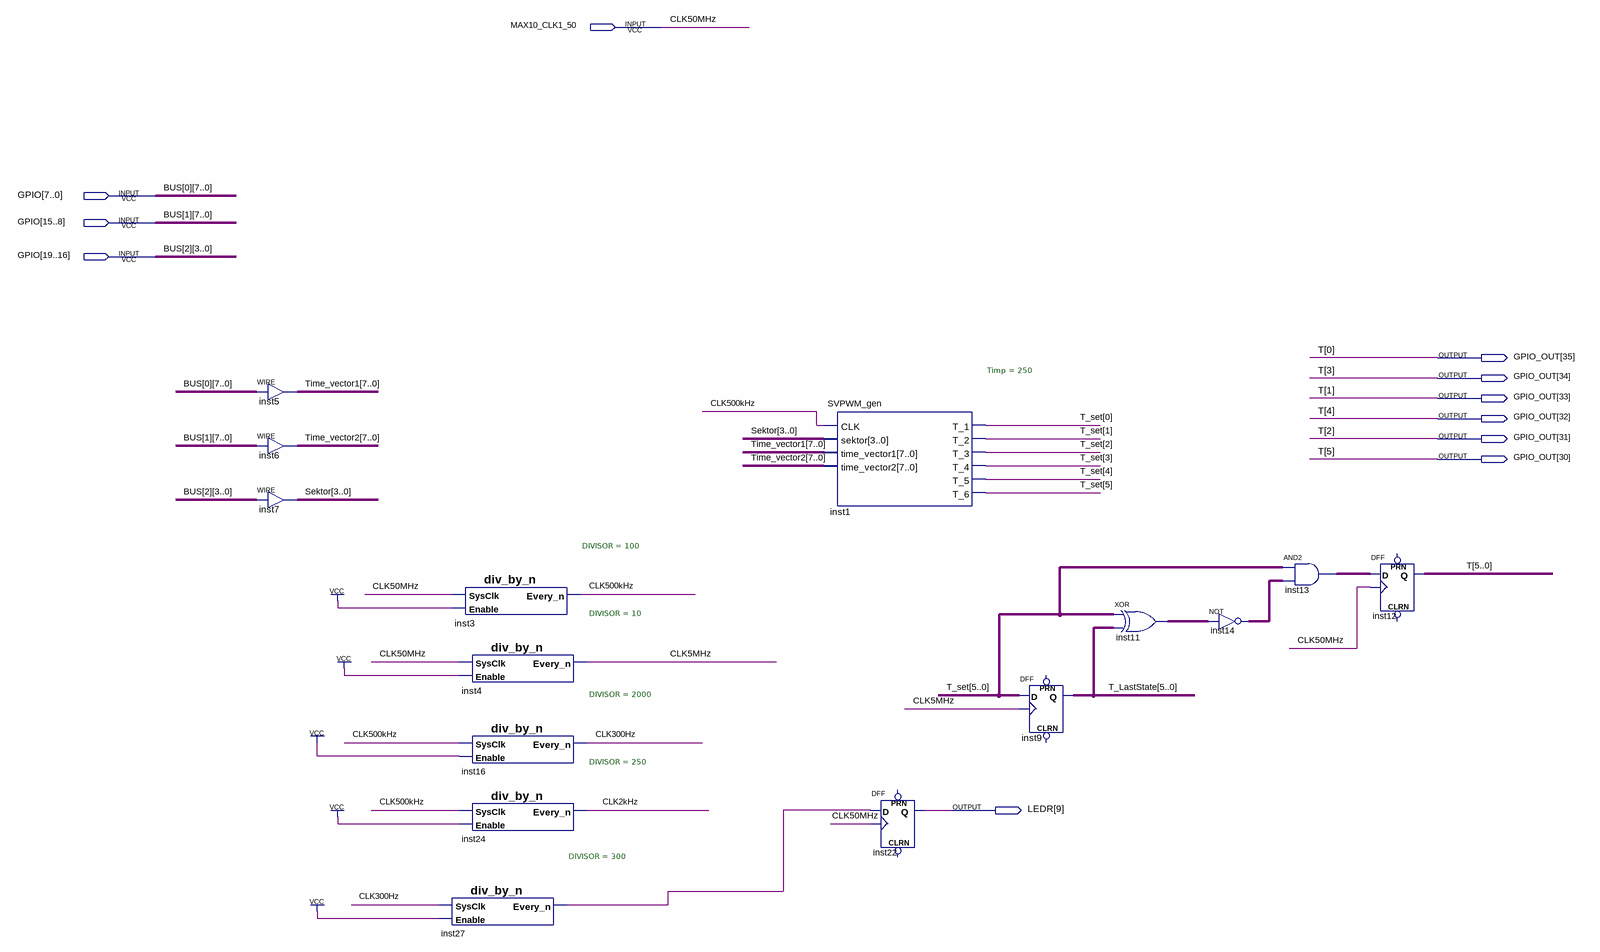
[diagram p0: schematic sheet]
// Quartus schematic TOP_SVPWM.bdf as structural Verilog: 15 symbols, 11 pins
module TOP_SVPWM (
  input  MAX10_CLK1_50,
  input  [19:0] GPIO,
  output [35:30] GPIO_OUT,
  output [9:9] LEDR
);

  wire CLK2kHz, CLK5MHz, CLK300Hz, CLK500kHz, inst27_every_n;
  wire [3:0] Sektor;
  wire [5:0] inst11_out, inst13_out, inst14_out, T_LastState, T_set;
  wire [7:0] Time_vector1, Time_vector2;

  assign Time_vector1 = GPIO[7:0];  // WIRE inst5
  assign Time_vector2 = GPIO[15:8];  // WIRE inst6
  assign Sektor = GPIO[19:16];  // WIRE inst7
  div_by_n #(.DIVISOR(100)) inst3 (.SysClk(MAX10_CLK1_50), .Enable(1'b1), .Every_n(CLK500kHz));
  div_by_n #(.DIVISOR(10)) inst4 (.SysClk(MAX10_CLK1_50), .Enable(1'b1), .Every_n(CLK5MHz));
  div_by_n #(.DIVISOR(2000)) inst16 (.SysClk(CLK500kHz), .Enable(1'b1), .Every_n(CLK300Hz));
  div_by_n #(.DIVISOR(250)) inst24 (.SysClk(CLK500kHz), .Enable(1'b1), .Every_n(CLK2kHz));
  div_by_n #(.DIVISOR(300)) inst27 (.SysClk(CLK300Hz), .Enable(1'b1), .Every_n(inst27_every_n));
  SVPWM_gen #(.Timp(250)) inst1 (
    .CLK(CLK500kHz), .sektor(Sektor), .time_vector1(Time_vector1), .time_vector2(Time_vector2),
    .T_1(T_set[0]), .T_2(T_set[1]), .T_3(T_set[2]), .T_4(T_set[3]), .T_5(T_set[4]), .T_6(T_set[5]));
  DFF inst22 (.CLK(MAX10_CLK1_50), .D(inst27_every_n), .Q(LEDR[9]));  // open: CLRN, PRN
  DFF inst9[5:0] (.CLK(CLK5MHz), .D(T_set), .Q(T_LastState));  // open: CLRN, PRN
  assign inst11_out = T_set ^ T_LastState;  // XOR inst11, 6 bits wide
  assign inst14_out = ~inst11_out;  // NOT inst14, 6 bits wide
  assign inst13_out = T_set & inst14_out;  // AND2 inst13, 6 bits wide
  DFF inst12[5:0] (
    .CLK(MAX10_CLK1_50), .D(inst13_out),
    .Q({GPIO_OUT[30], GPIO_OUT[32], GPIO_OUT[34], GPIO_OUT[31], GPIO_OUT[33], GPIO_OUT[35]}));  // open: CLRN, PRN

  // Other names for the same wires on the sheet: BUS_0[7:0] = GPIO[7:0]; BUS_1[7:0] = GPIO[15:8];
  //   BUS_2[3:0] = GPIO[19:16]; CLK50MHz = MAX10_CLK1_50;
  //   T[5:0] = {GPIO_OUT[30], GPIO_OUT[32], GPIO_OUT[34], GPIO_OUT[31], GPIO_OUT[33], GPIO_OUT[35]}
endmodule
